# Altium schematic sheet Sheet3 - Alimentations.SchDoc
size A4
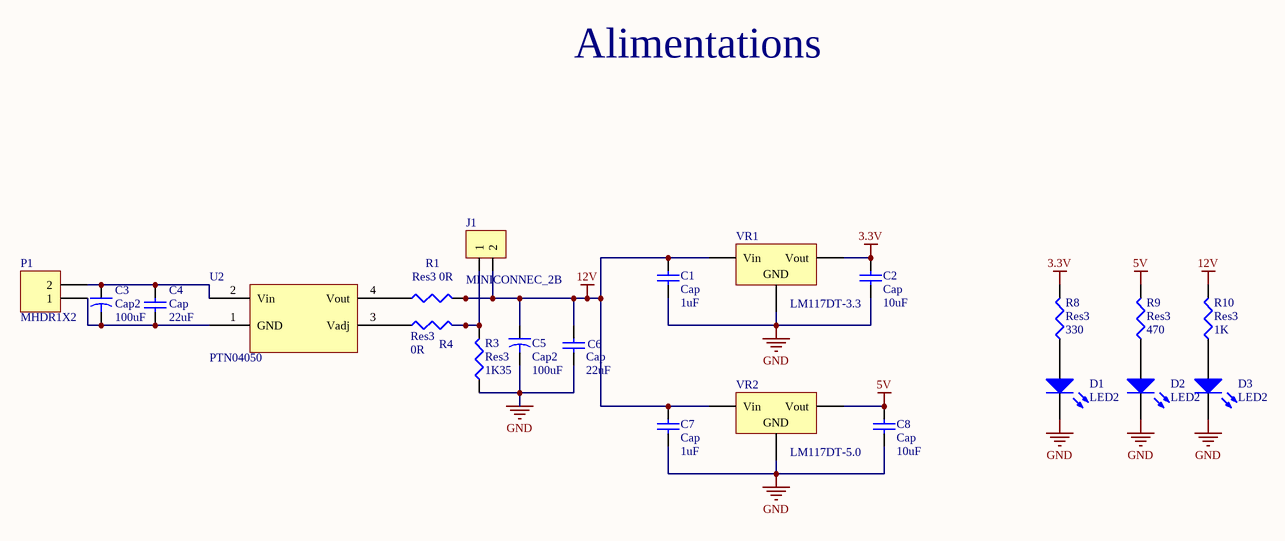
[diagram p0: Sheet3 - Alimentations.SchDoc]

## Parts
C1  Cap  value 1uF  [RAD-0.3]
C2  Cap  value 10uF  [RAD-0.3]
C3  Cap2  value 100uF  [CAPR5-4X5]
C4  Cap  value 22uF  [RAD-0.3]
C5  Cap2  value 100uF  [CAPR5-4X5]
C6  Cap  value 22uF  [RAD-0.3]
C7  Cap  value 1uF  [RAD-0.3]
C8  Cap  value 10uF  [RAD-0.3]
D1  LED2  [DSO-F2/D6.1]
D2  LED2  [DSO-F2/D6.1]
D3  LED2  [DSO-F2/D6.1]
J1  MINICONNEC_2B  [MINICONNEC_C]
P1  MHDR1X2  [MHDR1X2]
R1  Res3  value 0R  [RESC1608L]
R3  Res3  value 1K35  [RESC1608L]
R4  Res3  value 0R  [RESC1608L]
R8  Res3  value 330  [RESC1608L]
R9  Res3  value 470  [RESC1608L]
R10  Res3  value 1K  [RESC1608L]
U2  PTN04050  [PTN04050]
VR1  LM117DT-3.3  [TO254P1510-3_4N]
VR2  LM117DT-5.0  [TO254P1510-3_4N]

## Nets
3.3V: C2.2 R8.2 VR1.3(Vout)
5V: C8.2 R9.2 VR2.3(Vout)
12V: C1.2 C5.1 C6.2 C7.2 J1.2 R1.2 R10.2 VR1.1(Vin) VR2.1(Vin)
GND: C1.1 C2.1 C5.2 C6.1 C7.1 C8.1 D1.2(K) D2.2(K) D3.2(K) R3.1 VR1.2(GND) VR2.2(GND)
NetC3_1: C3.1 C4.2 P1.2 U2.2(Vin)
NetC3_2: C3.2 C4.1 P1.1 U2.1(GND)
NetD1_1: D1.1(A) R8.1
NetD2_1: D2.1(A) R9.1
NetD3_1: D3.1(A) R10.1
NetJ1_1: J1.1 R3.2 R4.2
NetR1_1: R1.1 U2.4(Vout)
NetR4_1: R4.1 U2.3(Vadj)

## Notes on the sheet
- Alimentations

## Library data of the parts
C1 C2 C4 C6-C8 = Cap: Capacitor; Published: 8-Jun-2000; LatestRevisionDate: 17-Jul-2002; LatestRevisionNote: Re-released for DXP Platform.; PackageReference: RAD-0.3; Publisher: Altium Limited
C3 C5 = Cap2: Capacitor; Published: 23-Sep-2002; PackageReference: CAPR5-4X5; Publisher: Altium Limited
D1-D3 = LED2: Typical RED, GREEN, YELLOW, AMBER GaAs LED; Published: 8-Jun-2000; LatestRevisionDate: 17-Jul-2002; LatestRevisionNote: Re-released for DXP Platform.; PackageVersion: Feb-2002; PackageReference: 3.2X1.6X1.1; Publisher: Altium Limited
J1 = MINICONNEC_2B: Connecteur
P1 = MHDR1X2: Header, 2-Pin; LatestRevisionDate: 17-Jul-2002; LatestRevisionNote: Re-released for DXP Platform.; Publisher: Altium Limited
R1 R3 R4 R8-R10 = Res3: Resistor; Published: 8-Jun-2000; LatestRevisionDate: 29-May-2009; LatestRevisionNote: IPC-7351 Footprint Added.; PackageReference: J1-0603; Publisher: Altium Limited; PackageDescription: Chip Resistor
U2 = PTN04050: BOOST
VR1 VR2 = Volt Reg: Voltage Regulator; Published: 24-Mar-1999; LatestRevisionDate: 29-May-2009; LatestRevisionNote: IPC-7351 Footprint Added.; PackageReference: D2PAK; Publisher: Altium Limited; PackageDescription: 3-Pin Transistor Outline Package 2.54 mm Pitch, 15.1 mm Lead Span